# Altium schematic sheet Receive config.SchDoc
size A4; SheetNumber: 1; SheetTotal: 1
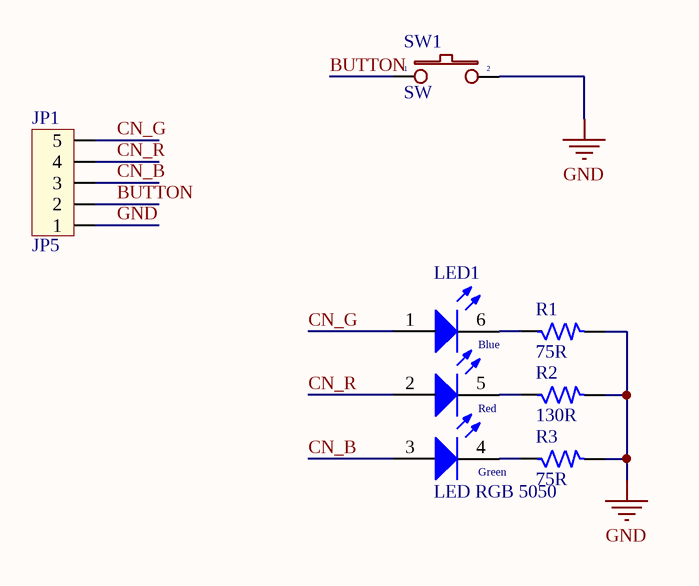
[diagram p0: Receive config.SchDoc]

## Parts
JP1  JP5  [XH2.54-5P]
LED1  LED RGB 5050  [LED RGB 5050]
R1  75R  [RES-SMD-0805]
R2  130R  [RES-SMD-0805]
R3  75R  [RES-SMD-0805]
SW1  SW  [SW2]

## Nets
GND: JP1.1 R1.2 R2.2 R3.2 SW1.2
BUTTON: JP1.2 SW1.1
CN_B: JP1.3 LED1.3
CN_G: JP1.5 LED1.1
CN_R: JP1.4 LED1.2
NetLED1_4: LED1.4 R3.1
NetLED1_5: LED1.5 R2.1
NetLED1_6: LED1.6 R1.1

## Notes on the sheet
- (in symbol LED RGB 5050) Blue; Red; Green

## Library data of the parts
JP1 = Header 5P: Connector 5; Value: Connector 5
LED1 = LED RGB 5050: PartNo: 150141M173100; Manufacturer: Würth Elektronik eiSos GmbH; Color: Red & Green & Blue; ComponentLink1Description: Manufacturer; ComponentLink1URL: http://www.we-online.de; Created by: Christin Otto; Created Date: June 2013; ComponentLink2Description: Datasheet; ComponentLink2URL: http://katalog.we-online.com/led/datasheet/150141M173100.pdf
R1-R3 = RES 1/4W: Tro 1/4W; Value: R1/4W - 1K
SW1 = SW2: Switch button 2 pin; Value: SW chip 2 pin